# Altium schematic sheet CAN Interface.SchDoc
size A
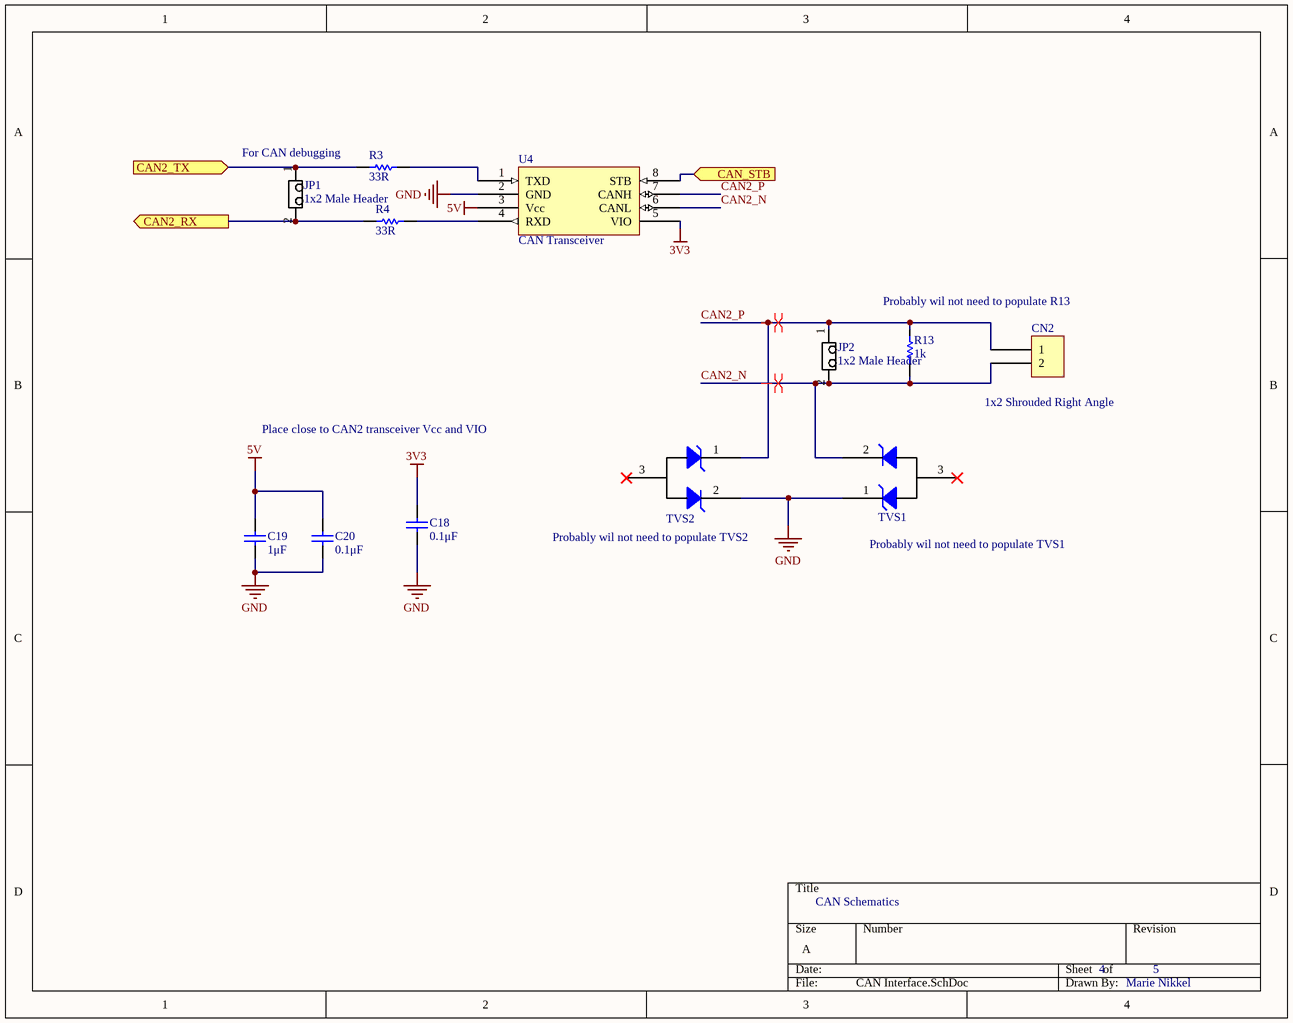
[diagram p0: CAN Interface.SchDoc]

## Parts
C18  0.1μF  [CAPC1608N(0603")]
C19  1μF  [CAPC1608N(0603")]
C20  0.1μF  [CAPC1608N(0603")]
CN2  1x2 Shrouded Right Angle  [2X1 Female Header]
JP1  1x2 Male Header  [2X1 Males Header]
JP2  1x2 Male Header  [2X1 Males Header]
R3  Resistance: 33R  [RESC1608X55X25NL10T15]  (hidden comment: RC0603FR-0733RL)
R4  Resistance: 33R  [RESC1608X55X25NL10T15]  (hidden comment: RC0603FR-0733RL)
R13  1k  [RESC1608N(0603")]
TVS1  PESD36VS2UT,215  [SOT95P245X110-3N]  (value not drawn)
TVS2  PESD36VS2UT,215  [SOT95P245X110-3N]  (value not drawn)
U4  CAN Transceiver  [8-SOIC]

## Ports
CAN2_RX (out), CAN2_TX (in), CAN_STB (in)

## Nets
3V3: C18.2(Cathode) U4.5(VIO)
5V: C19.2(Cathode) C20.2(Cathode) U4.3(Vcc)
GND: C18.1(Anode) C19.1(Anode) C20.1(Anode) TVS1.1(Cathode_1) TVS2.2(Cathode_2) U4.2(GND)
CAN2_N: CN2.2 JP2.2 R13.1 TVS1.2(Cathode_2) U4.6(CANL)
CAN2_P: CN2.1 JP2.1 R13.2 TVS2.1(Cathode_1) U4.7(CANH)
CAN2_RX: JP1.2 R4.1 ; port CAN2_RX
CAN2_TX: JP1.1 R3.1 ; port CAN2_TX
CAN_STB: U4.8(STB) ; port CAN_STB
NetR3_2: R3.2 U4.1(TXD)
NetR4_2: R4.2 U4.4(RXD)

Not connected (* = marked no-connect by the designer): TVS1 3(Common_Anode); TVS2 3(Common_Anode)

## Layout directives
differential pair: CAN2_N, CAN2_P

## Notes on the sheet
- For CAN debugging
- Probably wil not need to populate R13
- Place close to CAN2 transceiver Vcc and VIO
- (near TVS2) Probably wil not need to populate TVS2
- (near TVS1) Probably wil not need to populate TVS1
- CAN Schematics
- 4
- 5
- Marie Nikkel

## Library data of the parts
C18 C20 = 0.1uF 16V 0603 SMD, Ceramic: Capacitor, Ceramic, 16V, +/- 10%, 0603 SMD, X7R; Published: 16-04-26; Publisher: AUVic; PackageDescription: Chip Capacitor; Value: 0.1μF; Created By: Andy Bates; Supplier 1: Digi-Key; Supplier Part Number 1: 1276-1005-1-ND
C19 = 1uF 50V 0603 SMD, Ceramic: Capacitor, Ceramic, 50V, +/- 10%, 0603 SMD, X5R; PackageDescription: Chip Capacitor; Value: 1μF; Created By: Lyden Smith; Date Created: 2017-10-26; Supplier 1: Digi-Key; Supplier Part Number 1: 1276-1860-1-ND
CN2 = CMP-00010-3: 02 MTE HDR SRRA LATCH; PCB Mount Retention: Without; Number of Positions: 2; Row Spacing: 0.1inch; Contact Retention: Yes (With); PCB Mount Alignment: No (Without); Current Rating: 3A; PCB Thickness: 0.062inch; Insulation Resistance: 5GR; Gender: Male; Connector Type: Plug,Header,Pin; Tail Length: 3.3mm; Approvals: CSA; Pitch: 2.54mm; Contact Resistance: 15mR; Color: Black; REACH SVHC: Unknown; Contact Shape: Square; Number of Contacts: 2; PCB Mounting Orientation: Right Angle; Housing Material: Thermoplastic; Max Operating Temperature: 105°C; Mount: Through Hole; Package Quantity: 68; Contact Current Rating: 3A; Housing Color: Black; Contact Material: Brass; Min Operating Temperature: -65°C; Packaging: Rail/Tube; Height: 13.59mm; ELV: Compliant; Number of Rows: 1; Orientation: Right Angle; Lead Free: Lead Free; Mating Retention: Yes (With); Strain Relief: No (Without); Length: 7.62mm; Flammability Rating: UL94 V-0; Contact Plating: Gold,Tin,Matte; Contact Mating Length: 0.23inch; Contact Gender: Male; Termination: Crimp; Backwall/Post Interruptions: No (Without); Depth: 13.59mm; Mating Alignment: Yes (With)
JP1 JP2 = CMP-004-0001-1: Made By: Andy Bates; Source: AUVic_Schematic_Library_Connectors.SchLib; Pin Count: 2; Design Item ID: 1x2 Male Header; Component Type: Standard
R3 R4 = CMP-00060-1: Res Thick Film 0603 33 Ohm 1% 1/10W +/-100ppm/ßC Molded SMD Paper T/R; Max Power Dissipation: 100mW; Voltage Rating: 75V; Voltage Rating (DC): 50V; Temperature Coefficient: 100ppm/°C; Depth: 0.8mm; Military Standard: Not; Min Operating Temperature: -55°C; Termination: SMD/SMT; Weight: 7.1E-05oz; Number of Terminations: 2; Height: 0.45mm; Power Rating: 100mW; Composition: Thick Film; Length: 1.6mm; Packaging: Tape and Reel; Lead Pitch: 0.3mm; Lead Free: Lead Free; Max Operating Temperature: 155°C; REACH SVHC: No SVHC; Features: Moisture Resistant; Tolerance: 1%; Case/Package: 0603; Package Quantity: 1; Width: 0.8mm; Case Code (Metric): 1608; Number of Pins: 2; Case Code (Imperial): 0603
R13 = 1kR, 1%, 1/10W , 0603, SMD: Created By: Andy Bates; Publisher: AUVic; Date Created: 2017-05-10; Value: 1k; Supplier 1: Digikey; Supplier Part Number 1: 311-1.00KHRCT-ND
TVS1 TVS2 = PESD36VS2UT,215: TVS DIODE 36V 60V SOT23; Supplier 1: Digi-Key; Created By: Miguel Manguerra; Date Created: 2020-05-18; Supplier Part Number 1: 1727-5397-1-ND
U4 = CMP-032-0000-2: 1/1 Transceiver Half CANbus 8-SO; Data Rate: 1Mbps; Max Supply Voltage: 5.5V; Propagation Delay: 250ns; Number of Transceivers: 1; Nominal Supply Current: 70mA; Min Supply Voltage: 4.5V; Min Operating Temperature: -40°C; Radiation Hardening: No; Packaging: Tape and Reel; Turn-On Delay Time: 250ns; Case/Package: SO; Contact Plating: Gold; Package Quantity: 2500; Number of Pins: 8; Max Supply Current: 70mA; Max Operating Temperature: 150°C; Interface: CAN; Mount: Surface Mount; Lead Free: Lead Free